# EAGLE schematic EHDD_LAB_1 (EAGLE 7.7.0)
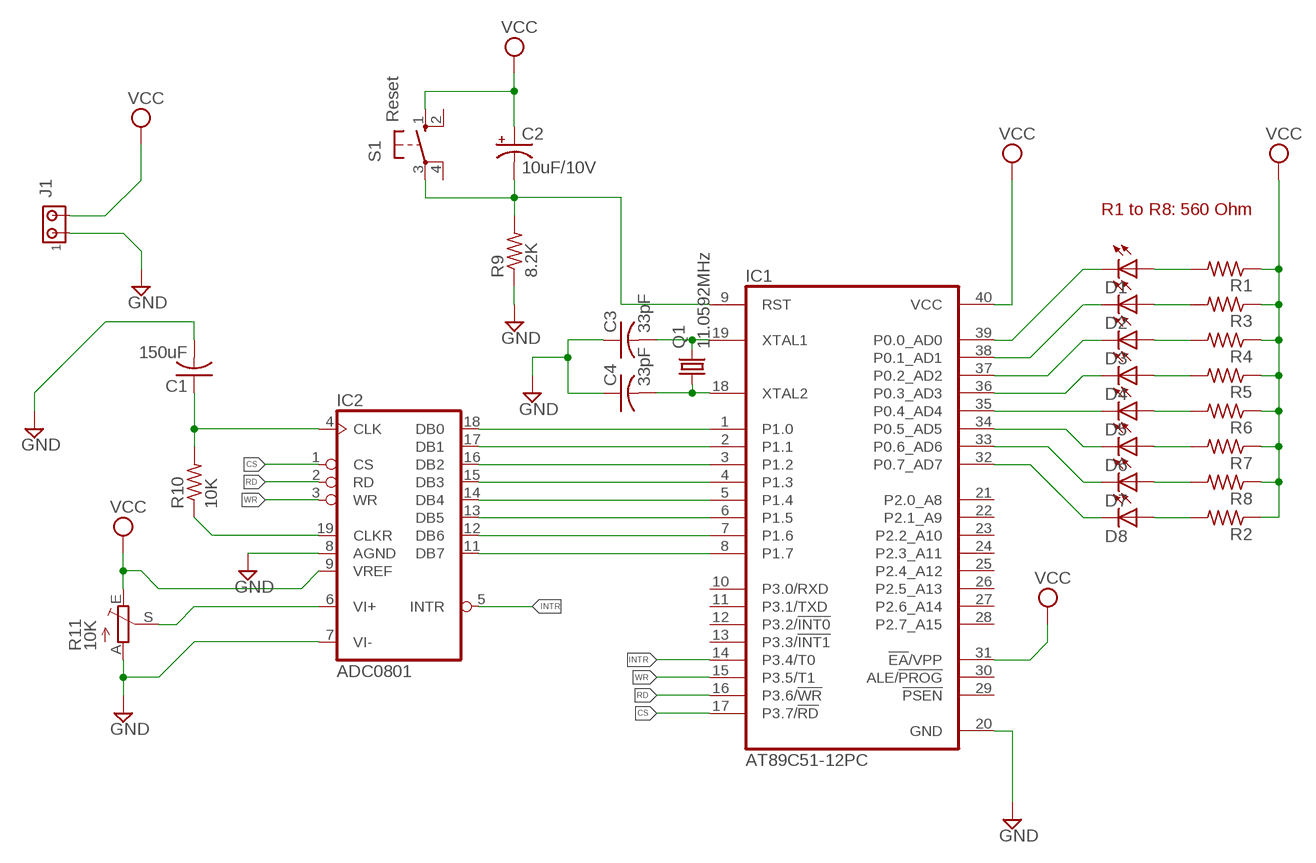
[diagram p0: schematic, sheet 1]

## Parts
C1  150uF  C-US025-025X050  [C025-025X050]
C2  10uF/10V  CPOL-USE2.5-5  [E2,5-5]
C3  33pF  C-US025-025X050  [C025-025X050]
C4  33pF  C-US025-025X050  [C025-025X050]
D1  LEDCHIPLED_0805  [CHIPLED_0805]
D2  LEDCHIPLED_0805  [CHIPLED_0805]
D3  LEDCHIPLED_0805  [CHIPLED_0805]
D4  LEDCHIPLED_0805  [CHIPLED_0805]
D5  LEDCHIPLED_0805  [CHIPLED_0805]
D6  LEDCHIPLED_0805  [CHIPLED_0805]
D7  LEDCHIPLED_0805  [CHIPLED_0805]
D8  LEDCHIPLED_0805  [CHIPLED_0805]
IC1  AT89C51-12PC  [DIL40]
IC2  ADC0801  [DIL20]
J1  MTA02-100  [10X02MTA]
Q1  11.0592MHz  CRYSTALTC26H  [TC26H]
R1  R-US_R2512  [R2512]
R2  R-US_R2512  [R2512]
R3  R-US_R2512  [R2512]
R4  R-US_R2512  [R2512]
R5  R-US_R2512  [R2512]
R6  R-US_R2512  [R2512]
R7  R-US_R2512  [R2512]
R8  R-US_R2512  [R2512]
R9  8.2K  R-US_R2512  [R2512]
R10  10K  R-US_R2512  [R2512]
R11  10K  TRIM_EU-B25U  [B25U]
S1  Reset  10-XX  [B3F-10XX]

## Nets
CS: IC1.17(P3.7/!RD) IC2.1(CS)
GND: C1.2 C3.1 C4.1 IC1.20(GND) IC2.7(VI-) IC2.8(AGND) J1.1 R9.1 R11.A
INTR: IC1.14(P3.4/T0) IC2.5(INTR)
N$1: IC1.1(P1.0) IC2.18(DB0)
N$2: IC1.2(P1.1) IC2.17(DB1)
N$3: IC1.3(P1.2) IC2.16(DB2)
N$4: IC1.4(P1.3) IC2.15(DB3)
N$5: IC1.5(P1.4) IC2.14(DB4)
N$6: IC1.6(P1.5) IC2.13(DB5)
N$7: IC1.7(P1.6) IC2.12(DB6)
N$8: IC1.8(P1.7) IC2.11(DB7)
N$9: C2.- IC1.9(RST) R9.2 S1.3(P)
N$10: C3.2 IC1.19(XTAL1) Q1.2
N$11: D1.C IC1.39(P0.0_AD0)
N$12: D2.C IC1.38(P0.1_AD1)
N$13: D3.C IC1.37(P0.2_AD2)
N$14: C4.2 IC1.18(XTAL2) Q1.1
N$15: D4.C IC1.36(P0.3_AD3)
N$16: D5.C IC1.35(P0.4_AD4)
N$17: D6.C IC1.34(P0.5_AD5)
N$18: D7.C IC1.33(P0.6_AD6)
N$19: D8.C IC1.32(P0.7_AD7)
N$20: D1.A R1.2
N$21: D2.A R3.2
N$22: D3.A R4.2
N$23: D4.A R5.2
N$24: D5.A R6.2
N$25: D6.A R7.2
N$26: D7.A R8.2
N$27: D8.A R2.2
N$30: IC2.6(VI+) R11.S
N$33: IC2.19(CLKR) R10.1
N$35: C1.1 IC2.4(CLK) R10.2
RD: IC1.16(P3.6/!WR) IC2.2(RD)
VCC: C2.+ IC1.31(!EA!/VPP) IC1.40(VCC) IC2.9(VREF) J1.2 R1.1 R2.1 R3.1 R4.1 R5.1 R6.1 R7.1 R8.1 R11.E S1.1(S)
WR: IC1.15(P3.5/T1) IC2.3(WR)
Unconnected: IC1.10(P3.0/RXD) IC1.11(P3.1/TXD) IC1.12(P3.2/!INT0) IC1.13(P3.3/!INT1) IC1.21(P2.0_A8) IC1.22(P2.1_A9) IC1.23(P2.2_A10) IC1.24(P2.3_A11) IC1.25(P2.4_A12) IC1.26(P2.5_A13) IC1.27(P2.6_A14) IC1.28(P2.7_A15) IC1.29(!PSEN) IC1.30(ALE/!PROG) S1.2(S1) S1.4(P1)

## Notes on the sheet
- R1 to R8: 560 Ohm

## Power pins joined to a net without a drawn wire
GND: IC2.10(GND)
VCC: IC2.20(VCC)

## Library data of the parts
C1 C3 C4 = rcl:C-US: CAPACITOR, American symbol
C2 = rcl:CPOL-US: POLARIZED CAPACITOR, American symbol
D1-D8 = led:LED: LED OSRAM: - CHIPLED LG R971, LG N971, LY N971, LG Q971, LY Q971, LO R971, LY R971 LH N974, LH R974 LS Q976, LO Q976, LY Q976 LO Q996 - Hyper CHIPLED LW Q18S LB Q993, LB Q99A, LB R99A - SideLED LS A670, LO A670, LY A670, LG A670, LP A670 LB A673, LV A673, LT A673, LW A673 LH A674 LY A675 LS A676, LA A676, LO A676, LY A676, LW A676 LS A679, LY A679, LG A679 - Hyper Micro SIDELED® LS Y876, LA Y876, LO Y876, LY Y876 LT Y87S - SmartLED LW L88C, LW L88S LB L89C, LB L89S, LG L890 LS L89K, LO L89K, LY L89K LS L896, LA L896, LO L896, LY L896 - TOPLED LS T670, LO T670, LY T670, LG T670, LP T670 LSG T670, LSP T670, LSY T670, LOP T670, LYG T670 LG T671, LOG T671, LSG T671 LB T673, LV T673, LT T673, LW T673 LH T674 LS T676, LA T676, LO T676, LY T676, LB T676, LH T676, LSB T676, LW T676 LB T67C, LV T67C, LT T67C, LS T67K, LO T67K, LY T67K, LW E67C LS E67B, LA E67B, LO E67B, LY E67B, LB E67C, LV E67C, LT E67C LW T67C LS T679, LY T679, LG T679 LS T770, LO T770, LY T770, LG T770, LP T770 LB T773, LV T773, LT T773, LW T773 LH T774 LS E675, LA E675, LY E675, LS T675 LS T776, LA T776, LO T776, LY T776, LB T776 LHGB T686 LT T68C, LB T68C - Hyper Mini TOPLED® LB M676 - Mini TOPLED Santana® LG M470 LS M47K, LO M47K, LY M47K Source: http://www.osram.convergy.de LUXEON: - LUMILED® LXK2-PW12-R00, LXK2-PW12-S00, LXK2-PW14-U00, LXK2-PW14-V00 LXK2-PM12-R00, LXK2-PM12-S00, LXK2-PM14-U00 LXK2-PE12-Q00, LXK2-PE12-R00, LXK2-PE12-S00, LXK2-PE14-T00, LXK2-PE14-U00 LXK2-PB12-K00, LXK2-PB12-L00, LXK2-PB12-M00, LXK2-PB14-N00, LXK2-PB14-P00, LXK2-PB14-Q00 LXK2-PR12-L00, LXK2-PR12-M00, LXK2-PR14-Q00, LXK2-PR14-R00 LXK2-PD12-Q00, LXK2-PD12-R00, LXK2-PD12-S00 LXK2-PH12-R00, LXK2-PH12-S00 LXK2-PL12-P00, LXK2-PL12-Q00, LXK2-PL12-R00 Source: www.luxeon.com KINGBRIGHT: KA-3528ASYC Source: www.kingbright.com
IC1 = atmel:AT89C51-*: 8-bit Microcontroller with 4K Bytes Flash Not Recommended for New Designs. Use AT89S51. Source: http://www.atmel.com/dyn/resources/prod_documents/doc0265.; OC_FARNELL: unknown; OC_NEWARK: unknown
IC2 = linear:ADC0801: 8-bit A/D CONVERTER
J1 = con-amp:MTA02-100: AMP connector
Q1 = crystal:CRYSTAL: CRYSTAL; OC_FARNELL: unknown; OC_NEWARK: unknown
R1-R10 = rcl:R-US_: RESISTOR, American symbol
R11 = pot:TRIM_EU-: POTENTIOMETER
S1 = switch-omron:10-XX: OMRON SWITCH; MPN: B3F-1000; OC_FARNELL: 176432; OC_NEWARK: 36M3542